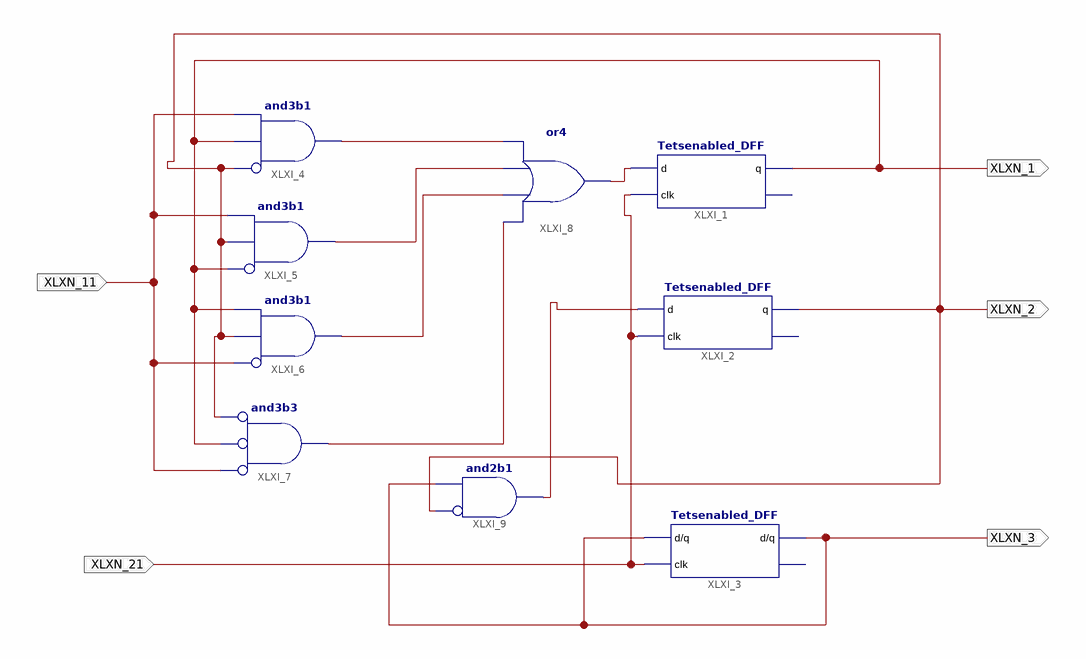
[diagram p0: schematic sheet 1]
// Xilinx ISE schematic Final.sch (virtex6) as structural Verilog: 9 symbols, 5 ports
module Final (
  input  XLXN_11,
  input  XLXN_21,
  output XLXN_1,
  output XLXN_2,
  output XLXN_3
);

  wire XLXN_5, XLXN_6, XLXN_8, XLXN_9, XLXN_10, XLXN_19;

  Tetsenabled_DFF XLXI_1 (.d(XLXN_5), .clk(XLXN_21), .q(XLXN_1));  // open: q1
  Tetsenabled_DFF XLXI_2 (.d(XLXN_19), .clk(XLXN_21), .q(XLXN_2));  // open: q1
  Tetsenabled_DFF XLXI_3 (.d(XLXN_3), .clk(XLXN_21), .q(XLXN_3));  // open: q1
  and XLXI_4 (XLXN_6, ~XLXN_2, XLXN_1, XLXN_11);  // and3b1
  and XLXI_5 (XLXN_10, ~XLXN_1, XLXN_2, XLXN_11);  // and3b1
  and XLXI_6 (XLXN_8, ~XLXN_11, XLXN_2, XLXN_1);  // and3b1
  and XLXI_7 (XLXN_9, ~XLXN_11, ~XLXN_1, ~XLXN_2);  // and3b3
  or XLXI_8 (XLXN_5, XLXN_9, XLXN_8, XLXN_10, XLXN_6);
  and XLXI_9 (XLXN_19, ~XLXN_2, XLXN_3);  // and2b1
endmodule
